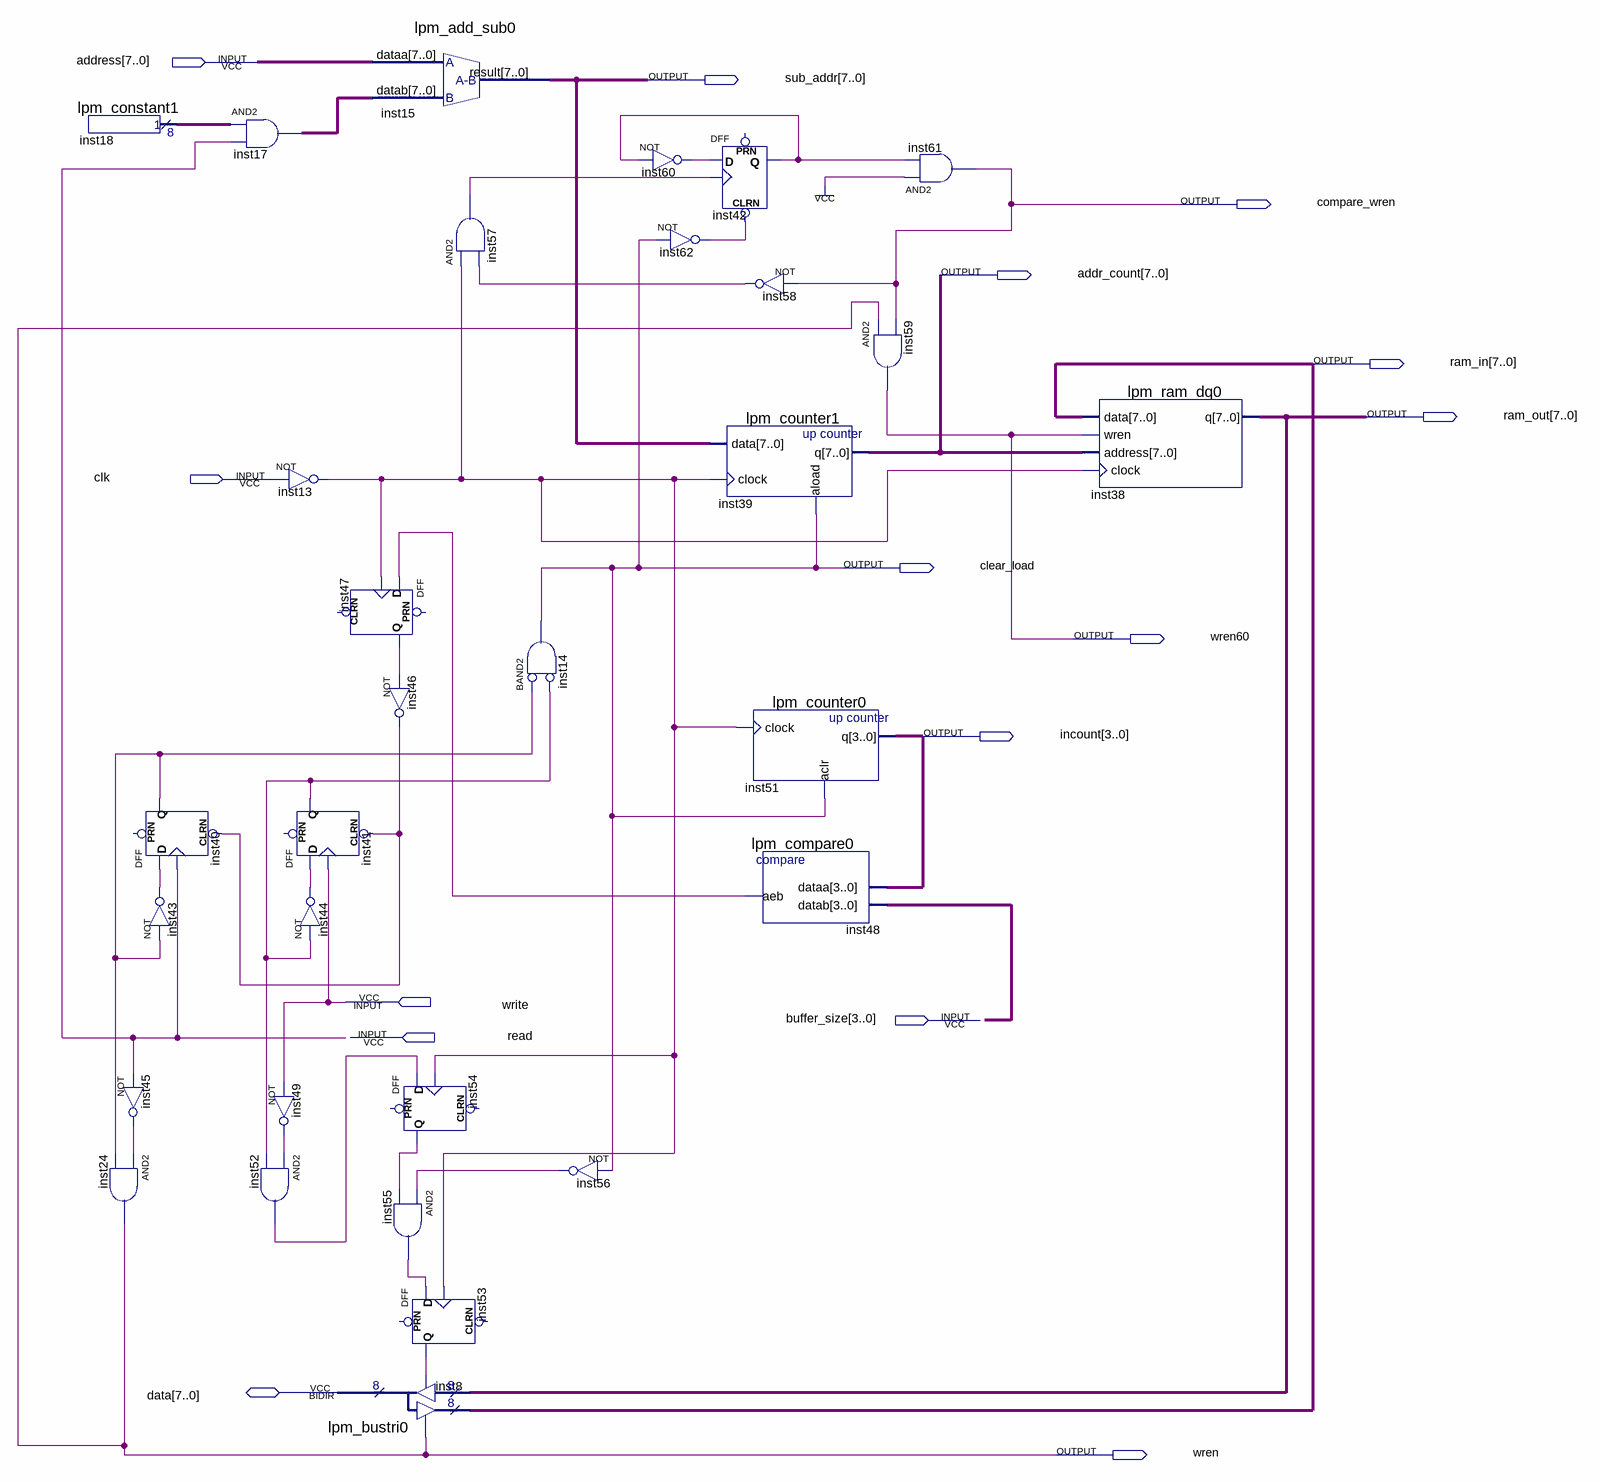
[diagram p0: schematic sheet]
// Quartus schematic RAM.bdf as structural Verilog: 31 symbols, 15 pins
module RAM (
  input  [7:0] address,
  input  clk,
  input  write,
  input  [3:0] buffer_size,
  input  read,
  inout  [7:0] data,
  output [7:0] sub_addr,
  output compare_wren,
  output [7:0] addr_count,
  output [7:0] ram_in,
  output [7:0] ram_out,
  output clear_load,
  output wren60,
  output [3:0] incount,
  output wren
);

  wire inst13_out, inst40_q, inst41_q, inst42_q, inst43_out, inst44_out, inst45_out, inst46_out, inst47_q,
       inst48_aeb, inst49_out, inst52_out, inst53_q, inst54_q, inst55_out, inst56_out, inst57_out,
       inst58_out, inst60_out, inst62_out;
  wire [7:0] inst17_out, inst18_result;

  lpm_constant1 inst18 (.result(inst18_result));
  not inst45 (inst45_out, read);
  and inst24 (wren, inst45_out, inst40_q);
  DFF inst40 (.CLRN(inst46_out), .CLK(read), .D(inst43_out), .Q(inst40_q));  // open: PRN
  not inst43 (inst43_out, inst40_q);
  assign inst17_out = inst18_result & {8{read}};  // AND2 inst17, 8 bits wide
  and inst52 (inst52_out, inst49_out, inst41_q);
  not inst13 (inst13_out, clk);
  DFF inst41 (.CLRN(inst46_out), .CLK(write), .D(inst44_out), .Q(inst41_q));  // open: PRN
  not inst44 (inst44_out, inst41_q);
  not inst49 (inst49_out, write);
  lpm_add_sub0 inst15 (.dataa(address), .datab(inst17_out), .result(sub_addr));
  DFF inst47 (.CLK(inst13_out), .D(inst48_aeb), .Q(inst47_q));  // open: CLRN, PRN
  not inst46 (inst46_out, inst47_q);
  DFF inst54 (.CLK(inst13_out), .D(inst52_out), .Q(inst54_q));  // open: CLRN, PRN
  and inst55 (inst55_out, inst56_out, inst54_q);
  DFF inst53 (.CLK(inst13_out), .D(inst55_out), .Q(inst53_q));  // open: CLRN, PRN
  lpm_bustri0 inst8 (.enabledt(inst53_q), .data(ram_out), .enabletr(wren), .result(ram_in), .tridata(data));
  and inst57 (inst57_out, inst13_out, inst58_out);
  and inst14 (clear_load, ~inst40_q, ~inst41_q);  // BAND2
  not inst56 (inst56_out, clear_load);
  not inst60 (inst60_out, inst42_q);
  not inst62 (inst62_out, clear_load);
  DFF inst42 (.CLRN(inst62_out), .CLK(inst57_out), .D(inst60_out), .Q(inst42_q));  // open: PRN
  not inst58 (inst58_out, compare_wren);
  lpm_counter1 inst39 (.data(sub_addr), .clock(inst13_out), .aload(clear_load), .q(addr_count));
  lpm_counter0 inst51 (.clock(inst13_out), .aclr(clear_load), .q(incount));
  lpm_compare0 inst48 (.dataa(incount), .datab(buffer_size), .aeb(inst48_aeb));
  and inst59 (wren60, wren, compare_wren);
  and inst61 (compare_wren, 1'b1, inst42_q);
  lpm_ram_dq0 inst38 (.data(ram_in), .wren(wren60), .address(addr_count), .clock(inst13_out), .q(ram_out));
endmodule
